# Altium schematic sheet FPGA_POWER_DGND.SchDoc
size A3
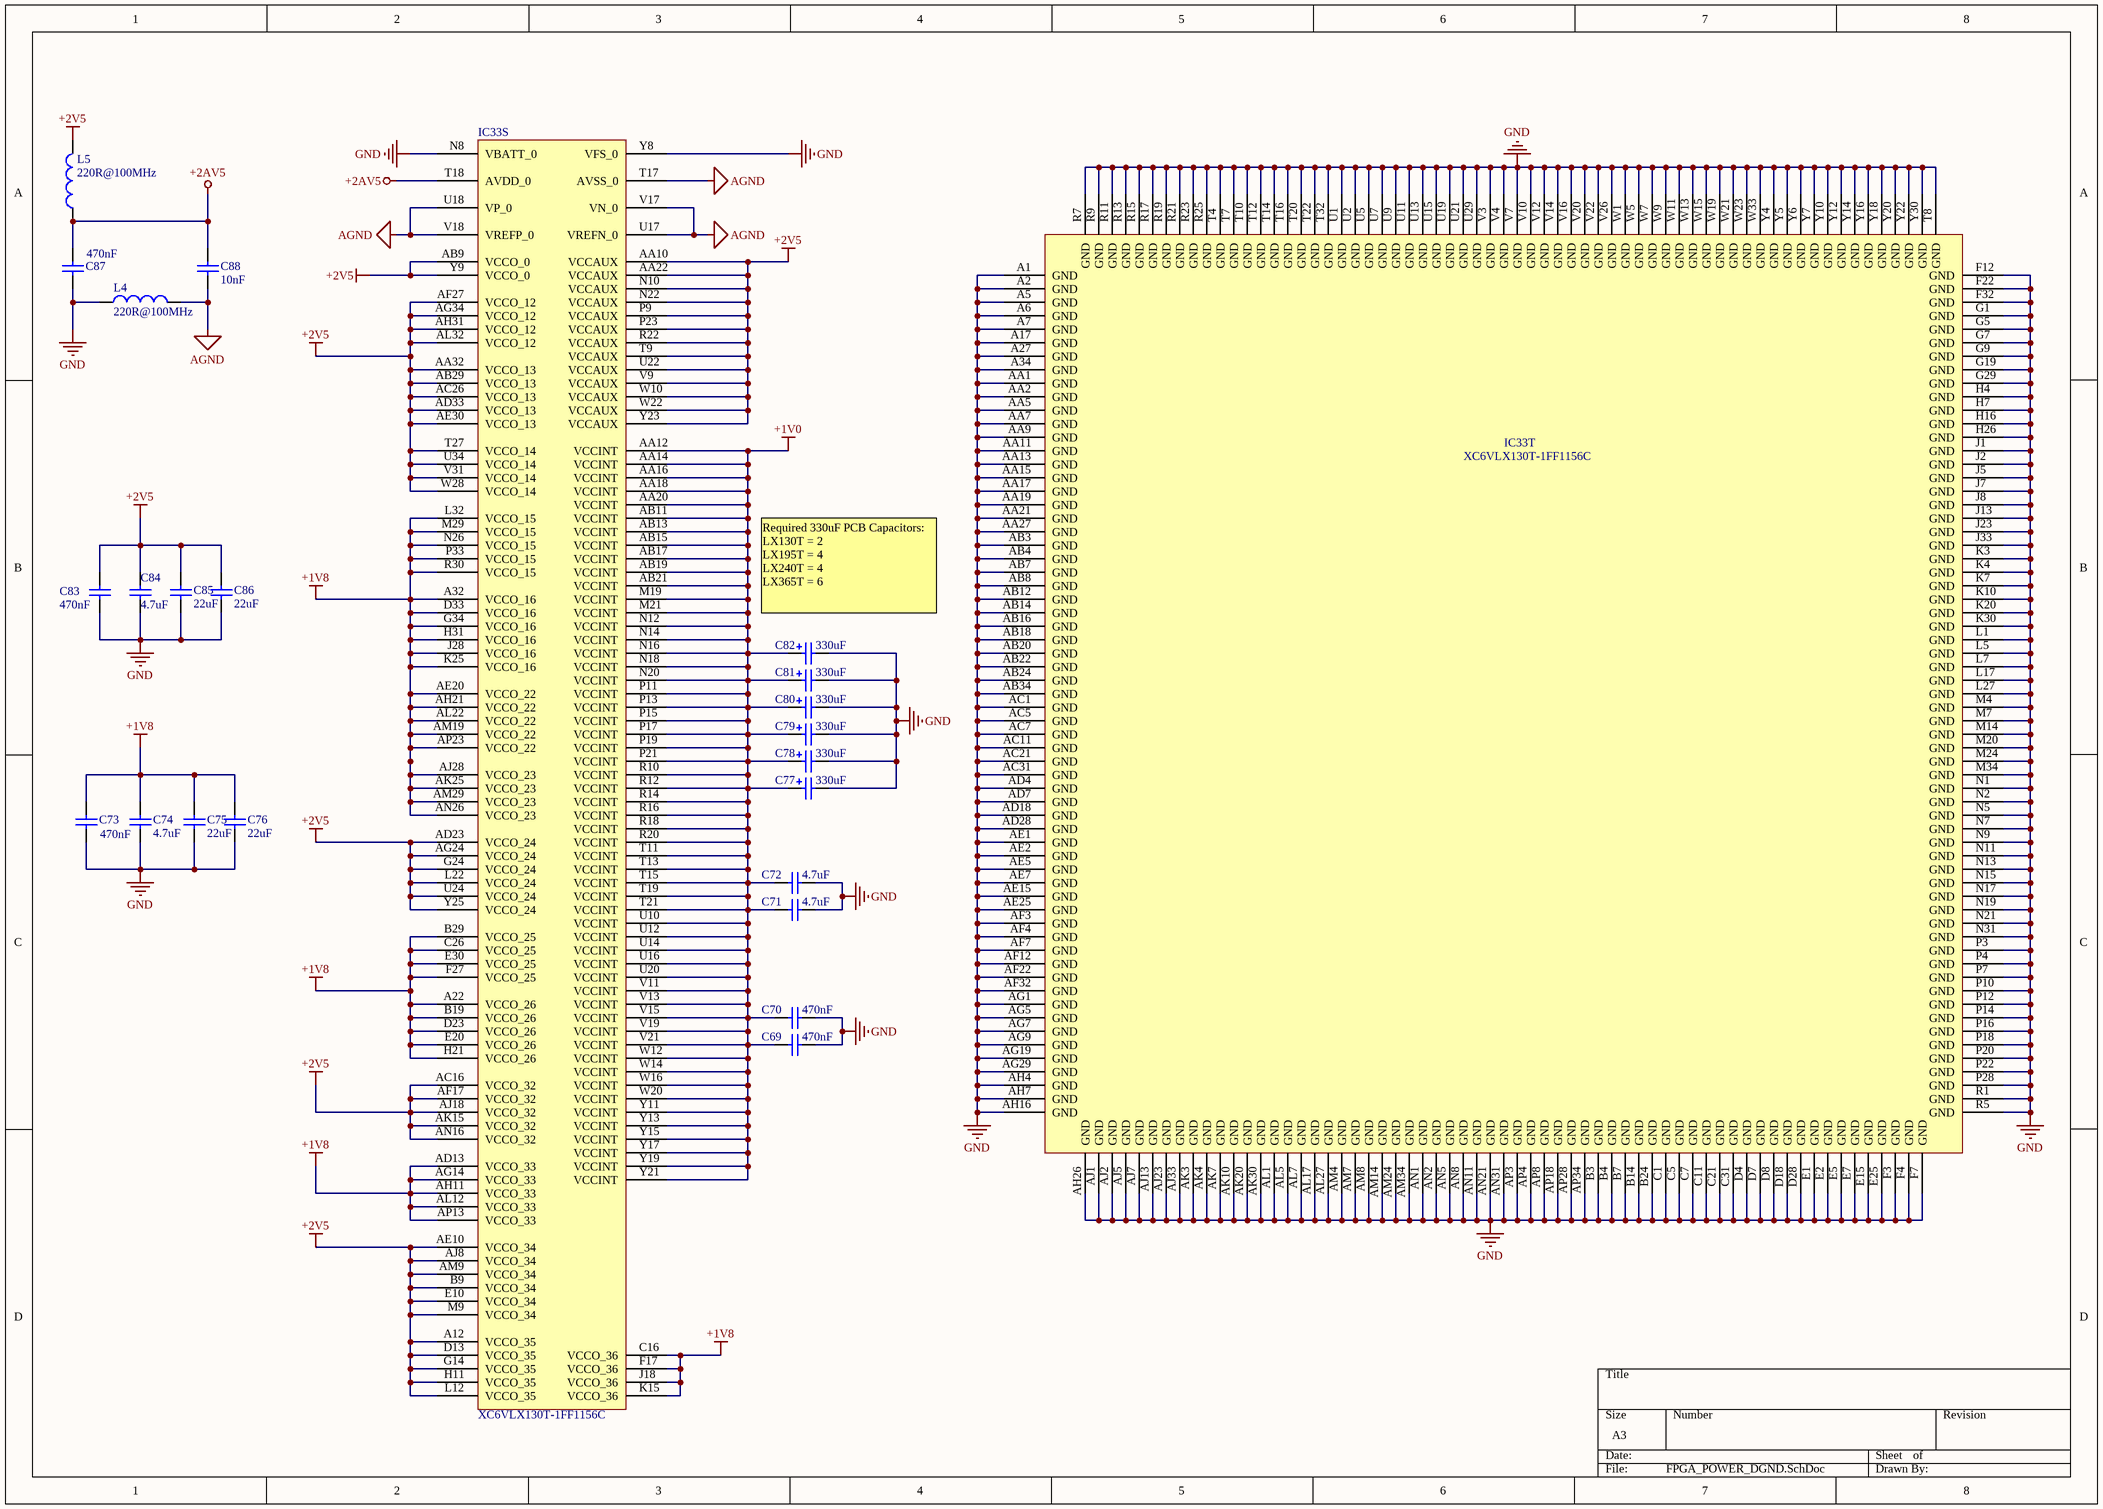
[diagram p0: FPGA_POWER_DGND.SchDoc]

## Parts
C69  470nF  [CC1005-0402]
C70  470nF  [CC1005-0402]
C71  4.7uF  [CC1608-0603]
C72  4.7uF  [CC1608-0603]
C73  470nF  [CC1005-0402]
C74  4.7uF  [CC1608-0603]
C75  22uF  [CC2012-0805]
C76  22uF  [CC2012-0805]
C77  330uF  [D]
C78  330uF  [D]
C79  330uF  [D]
C80  330uF  [D]
C81  330uF  [D]
C82  330uF  [D]
C83  470nF  [CC1005-0402]
C84  4.7uF  [CC1608-0603]
C85  22uF  [CC2012-0805]
C86  22uF  [CC2012-0805]
C87  470nF  [CC1005-0402]
C88  10nF  [CC1005-0402]
IC33  XC6VLX130T-1FF1156C  [FF1156]  (parts S,T of 20)
L4  Impedance: 220R@100MHz  [0603]  (hidden comment: 220R@100MHz Ferrite Bead)
L5  Impedance: 220R@100MHz  [0603]  (hidden comment: 220R@100MHz Ferrite Bead)

## Nets
+1V0: C69.2 C70.2 C71.1 C72.1 C77.1 C78.1 C79.1 C80.1 C81.1 C82.1 IC33.AA12(VCCINT) IC33.AA14(VCCINT) IC33.AA16(VCCINT) IC33.AA18(VCCINT) IC33.AA20(VCCINT) IC33.AB11(VCCINT) IC33.AB13(VCCINT) IC33.AB15(VCCINT) IC33.AB17(VCCINT) IC33.AB19(VCCINT) IC33.AB21(VCCINT) IC33.M19(VCCINT) IC33.M21(VCCINT) IC33.N12(VCCINT) IC33.N14(VCCINT) IC33.N16(VCCINT) IC33.N18(VCCINT) IC33.N20(VCCINT) IC33.P11(VCCINT) IC33.P13(VCCINT) IC33.P15(VCCINT) IC33.P17(VCCINT) IC33.P19(VCCINT) IC33.P21(VCCINT) IC33.R10(VCCINT) IC33.R12(VCCINT) IC33.R14(VCCINT) IC33.R16(VCCINT) IC33.R18(VCCINT) IC33.R20(VCCINT) IC33.T11(VCCINT) IC33.T13(VCCINT) IC33.T15(VCCINT) IC33.T19(VCCINT) IC33.T21(VCCINT) IC33.U10(VCCINT) IC33.U12(VCCINT) IC33.U14(VCCINT) IC33.U16(VCCINT) IC33.U20(VCCINT) IC33.V11(VCCINT) IC33.V13(VCCINT) IC33.V15(VCCINT) IC33.V19(VCCINT) IC33.V21(VCCINT) IC33.W12(VCCINT) IC33.W14(VCCINT) IC33.W16(VCCINT) IC33.W20(VCCINT) IC33.Y11(VCCINT) IC33.Y13(VCCINT) IC33.Y15(VCCINT) IC33.Y17(VCCINT) IC33.Y19(VCCINT) IC33.Y21(VCCINT)
+1V8: C73.1 C74.2 C75.2 C76.2 IC33.A22(VCCO_26) IC33.A32(VCCO_16) IC33.AD13(VCCO_33) IC33.AE20(VCCO_22) IC33.AG14(VCCO_33) IC33.AH11(VCCO_33) IC33.AH21(VCCO_22) IC33.AJ28(VCCO_23) IC33.AK25(VCCO_23) IC33.AL12(VCCO_33) IC33.AL22(VCCO_22) IC33.AM19(VCCO_22) IC33.AM29(VCCO_23) IC33.AN26(VCCO_23) IC33.AP13(VCCO_33) IC33.AP23(VCCO_22) IC33.B19(VCCO_26) IC33.B29(VCCO_25) IC33.C16(VCCO_36) IC33.C26(VCCO_25) IC33.D23(VCCO_26) IC33.D33(VCCO_16) IC33.E20(VCCO_26) IC33.E30(VCCO_25) IC33.F17(VCCO_36) IC33.F27(VCCO_25) IC33.G34(VCCO_16) IC33.H21(VCCO_26) IC33.H31(VCCO_16) IC33.J18(VCCO_36) IC33.J28(VCCO_16) IC33.K15(VCCO_36) IC33.K25(VCCO_16) IC33.L32(VCCO_15) IC33.M29(VCCO_15) IC33.N26(VCCO_15) IC33.P33(VCCO_15) IC33.R30(VCCO_15)
+2AV5: C87.1 C88.1 IC33.T18(AVDD_0) L5.1
+2V5: C83.1 C84.2 C85.2 C86.2 IC33.A12(VCCO_35) IC33.AA10(VCCAUX) IC33.AA22(VCCAUX) IC33.AA32(VCCO_13) IC33.AB9(VCCO_0) IC33.AB29(VCCO_13) IC33.AC16(VCCO_32) IC33.AC26(VCCO_13) IC33.AD23(VCCO_24) IC33.AD33(VCCO_13) IC33.AE10(VCCO_34) IC33.AE30(VCCO_13) IC33.AF17(VCCO_32) IC33.AF27(VCCO_12) IC33.AG24(VCCO_24) IC33.AG34(VCCO_12) IC33.AH31(VCCO_12) IC33.AJ8(VCCO_34) IC33.AJ18(VCCO_32) IC33.AK15(VCCO_32) IC33.AL32(VCCO_12) IC33.AM9(VCCO_34) IC33.AN16(VCCO_32) IC33.B9(VCCO_34) IC33.D13(VCCO_35) IC33.E10(VCCO_34) IC33.G14(VCCO_35) IC33.G24(VCCO_24) IC33.H11(VCCO_35) IC33.L12(VCCO_35) IC33.L22(VCCO_24) IC33.M9(VCCO_34) IC33.N10(VCCAUX) IC33.N22(VCCAUX) IC33.P9(VCCAUX) IC33.P23(VCCAUX) IC33.R22(VCCAUX) IC33.T9(VCCAUX) IC33.T27(VCCO_14) IC33.U22(VCCAUX) IC33.U24(VCCO_24) IC33.U34(VCCO_14) IC33.V9(VCCAUX) IC33.V31(VCCO_14) IC33.W10(VCCAUX) IC33.W22(VCCAUX) IC33.W28(VCCO_14) IC33.Y9(VCCO_0) IC33.Y23(VCCAUX) IC33.Y25(VCCO_24) L5.2
AGND: C88.2 IC33.T17(AVSS_0) IC33.U17(VREFN_0) IC33.U18(VP_0) IC33.V17(VN_0) IC33.V18(VREFP_0) L4.2
GND: C69.1 C70.1 C71.2 C72.2 C73.2 C74.1 C75.1 C76.1 C77.2 C78.2 C79.2 C80.2 C81.2 C82.2 C83.2 C84.1 C85.1 C86.1 C87.2 IC33.A1(GND) IC33.A2(GND) IC33.A5(GND) IC33.A6(GND) IC33.A7(GND) IC33.A17(GND) IC33.A27(GND) IC33.A34(GND) IC33.AA1(GND) IC33.AA2(GND) IC33.AA5(GND) IC33.AA7(GND) IC33.AA9(GND) IC33.AA11(GND) IC33.AA13(GND) IC33.AA15(GND) IC33.AA17(GND) IC33.AA19(GND) IC33.AA21(GND) IC33.AA27(GND) IC33.AB3(GND) IC33.AB4(GND) IC33.AB7(GND) IC33.AB8(GND) IC33.AB12(GND) IC33.AB14(GND) IC33.AB16(GND) IC33.AB18(GND) IC33.AB20(GND) IC33.AB22(GND) IC33.AB24(GND) IC33.AB34(GND) IC33.AC1(GND) IC33.AC5(GND) IC33.AC7(GND) IC33.AC11(GND) IC33.AC21(GND) IC33.AC31(GND) IC33.AD4(GND) IC33.AD7(GND) IC33.AD18(GND) IC33.AD28(GND) IC33.AE1(GND) IC33.AE2(GND) IC33.AE5(GND) IC33.AE7(GND) IC33.AE15(GND) IC33.AE25(GND) IC33.AF3(GND) IC33.AF4(GND) IC33.AF7(GND) IC33.AF12(GND) IC33.AF22(GND) IC33.AF32(GND) IC33.AG1(GND) IC33.AG5(GND) IC33.AG7(GND) IC33.AG9(GND) IC33.AG19(GND) IC33.AG29(GND) IC33.AH4(GND) IC33.AH7(GND) IC33.AH16(GND) IC33.AH26(GND) IC33.AJ1(GND) IC33.AJ2(GND) IC33.AJ5(GND) IC33.AJ7(GND) IC33.AJ13(GND) IC33.AJ23(GND) IC33.AJ33(GND) IC33.AK3(GND) IC33.AK4(GND) IC33.AK7(GND) IC33.AK10(GND) IC33.AK20(GND) IC33.AK30(GND) IC33.AL1(GND) IC33.AL5(GND) IC33.AL7(GND) IC33.AL17(GND) IC33.AL27(GND) IC33.AM4(GND) IC33.AM7(GND) IC33.AM8(GND) IC33.AM14(GND) IC33.AM24(GND) IC33.AM34(GND) IC33.AN1(GND) IC33.AN2(GND) IC33.AN5(GND) IC33.AN8(GND) IC33.AN11(GND) IC33.AN21(GND) IC33.AN31(GND) IC33.AP3(GND) IC33.AP4(GND) IC33.AP8(GND) IC33.AP18(GND) IC33.AP28(GND) IC33.AP34(GND) IC33.B3(GND) IC33.B4(GND) IC33.B7(GND) IC33.B14(GND) IC33.B24(GND) IC33.C1(GND) IC33.C5(GND) IC33.C7(GND) IC33.C11(GND) IC33.C21(GND) IC33.C31(GND) IC33.D4(GND) IC33.D7(GND) IC33.D8(GND) IC33.D18(GND) IC33.D28(GND) IC33.E1(GND) IC33.E2(GND) IC33.E5(GND) IC33.E7(GND) IC33.E15(GND) IC33.E25(GND) IC33.F3(GND) IC33.F4(GND) IC33.F7(GND) IC33.F12(GND) IC33.F22(GND) IC33.F32(GND) IC33.G1(GND) IC33.G5(GND) IC33.G7(GND) IC33.G9(GND) IC33.G19(GND) IC33.G29(GND) IC33.H4(GND) IC33.H7(GND) IC33.H16(GND) IC33.H26(GND) IC33.J1(GND) IC33.J2(GND) IC33.J5(GND) IC33.J7(GND) IC33.J8(GND) IC33.J13(GND) IC33.J23(GND) IC33.J33(GND) IC33.K3(GND) IC33.K4(GND) IC33.K7(GND) IC33.K10(GND) IC33.K20(GND) IC33.K30(GND) IC33.L1(GND) IC33.L5(GND) IC33.L7(GND) IC33.L17(GND) IC33.L27(GND) IC33.M4(GND) IC33.M7(GND) IC33.M14(GND) IC33.M20(GND) IC33.M24(GND) IC33.M34(GND) IC33.N1(GND) IC33.N2(GND) IC33.N5(GND) IC33.N7(GND) IC33.N8(VBATT_0) IC33.N9(GND) IC33.N11(GND) IC33.N13(GND) IC33.N15(GND) IC33.N17(GND) IC33.N19(GND) IC33.N21(GND) IC33.N31(GND) IC33.P3(GND) IC33.P4(GND) IC33.P7(GND) IC33.P10(GND) IC33.P12(GND) IC33.P14(GND) IC33.P16(GND) IC33.P18(GND) IC33.P20(GND) IC33.P22(GND) IC33.P28(GND) IC33.R1(GND) IC33.R5(GND) IC33.R7(GND) IC33.R9(GND) IC33.R11(GND) IC33.R13(GND) IC33.R15(GND) IC33.R17(GND) IC33.R19(GND) IC33.R21(GND) IC33.R23(GND) IC33.R25(GND) IC33.T4(GND) IC33.T7(GND) IC33.T8(GND) IC33.T10(GND) IC33.T12(GND) IC33.T14(GND) IC33.T16(GND) IC33.T20(GND) IC33.T22(GND) IC33.T32(GND) IC33.U1(GND) IC33.U2(GND) IC33.U5(GND) IC33.U7(GND) IC33.U9(GND) IC33.U11(GND) IC33.U13(GND) IC33.U15(GND) IC33.U19(GND) IC33.U21(GND) IC33.U29(GND) IC33.V3(GND) IC33.V4(GND) IC33.V7(GND) IC33.V10(GND) IC33.V12(GND) IC33.V14(GND) IC33.V16(GND) IC33.V20(GND) IC33.V22(GND) IC33.V26(GND) IC33.W1(GND) IC33.W5(GND) IC33.W7(GND) IC33.W9(GND) IC33.W11(GND) IC33.W13(GND) IC33.W15(GND) IC33.W19(GND) IC33.W21(GND) IC33.W23(GND) IC33.W33(GND) IC33.Y4(GND) IC33.Y5(GND) IC33.Y6(GND) IC33.Y7(GND) IC33.Y8(VFS_0) IC33.Y10(GND) IC33.Y12(GND) IC33.Y14(GND) IC33.Y16(GND) IC33.Y18(GND) IC33.Y20(GND) IC33.Y22(GND) IC33.Y30(GND) L4.1

## Notes on the sheet
- (near C82) Required 330uF PCB Capacitors:
  LX130T = 2
  LX195T = 4
  LX240T = 4
  LX365T = 6

## Library data of the parts
C69 C70 C73 C83 C87 = CC0402_470NF_16V_10%_X5R: Capacitor; Manufacturer1: TDK; Manufacturer1 PN: C1005X5R1C474K; TC: X5R; Tolerance: ±10%; Voltage: 16V; Published: 8-Jun-2000; LatestRevisionDate: 17-Jul-2002; LatestRevisionNote: Re-released for DXP Platform.; PackageReference: RAD-0.3; Publisher: Altium Limited; Distributor1: Digikey; Distributor1 PN: 445-4976-1-ND; Case: 0402; Value: 470nF
C71 C72 C74 C84 = CC0603_4.7UF_10V_10%_X5R: Capacitor; Manufacturer1: TDK; Manufacturer1 PN: C1608X5R1A475K; TC: X5R; Tolerance: ±10%; Voltage: 10V; Published: 8-Jun-2000; LatestRevisionDate: 17-Jul-2002; LatestRevisionNote: Re-released for DXP Platform.; PackageReference: RAD-0.3; Publisher: Altium Limited; Distributor1: Digikey; Distributor1 PN: 445-5170-1-ND; Case: 0603; Value: 4.7uF
C75 C76 C85 C86 = CC0805_22UF_6.3V_20%_X5R: Capacitor; Manufacturer1: TDK; Manufacturer1 PN: C2012X5R0J226M; TC: X5R; Tolerance: ±20%; Voltage: 6.3V; Published: 8-Jun-2000; LatestRevisionDate: 17-Jul-2002; LatestRevisionNote: Re-released for DXP Platform.; PackageReference: RAD-0.3; Publisher: Altium Limited; Distributor1: Digikey; Distributor1 PN: 445-1422-1-ND; Case: 0805; Value: 22uF
C77-C82 = CP2917_330UF_6.3V_20%_TANT: Polarized Capacitor Tantalum; Manufacturer1: Kemet; Manufacturer1 PN: T520D337M006ATE025; Tolerance: ±20%; Voltage: 6.3V; ESR: 25mOhm; Published: 8-Jun-2000; LatestRevisionDate: 17-Jul-2002; LatestRevisionNote: Re-released for DXP Platform.; PackageReference: RB7.6-15; Publisher: Altium Limited; Case: 2917; Distributor1: Digikey; Distributor1 PN: 399-4053-1-ND; TC: Tantalum; Value: 330uF
C88 = CC0402_10NF_25V_10%_X7R: Capacitor; Manufacturer1: TDK; Manufacturer1 PN: C1005X7R1E103K; TC: X7R; Tolerance: ±10%; Voltage: 25V; Published: 8-Jun-2000; LatestRevisionDate: 17-Jul-2002; LatestRevisionNote: Re-released for DXP Platform.; PackageReference: RAD-0.3; Publisher: Altium Limited; Distributor1: Digikey; Distributor1 PN: 445-1260-1-ND; Case: 0402; Value: 10nF
IC33 = XC6VLX130T-1FF1156C: Virtex-6 LXT Platform FPGA, 600 User I/Os, 20 GTXs, 1156-Ball FFBGA, Speed Grade 1, Commercial Grade; FirstPublished: 17-Nov-2009; DatasheetVersion: v2.0, Sep-2009; PackageVersion: ver1.0, Jun-2009; PackageReference: FF1156; Publisher: Altium Limited; PackageDescription: 1156-Ball Flip-Chip Fine Pitch Ball Grid Array (FF1156); Code_JEDEC: MS-034-AAR-1; Code_IPC: BGA100P34X34-1156; ComponentLink1Description: Virtex-6 Datasheet; ComponentLink1URL: http://www.xilinx.com/support/documentation/data_sheets/ds150.pdf; ComponentLink2Description: Pinout Specification; ComponentLink2URL: http://www.xilinx.com/support/packagefiles/virtex-6-pkgs.htm; ComponentLink3Description: FF1156 Package Drawing; ComponentLink3URL: http://www.xilinx.com/support/documentation/package_specs/ff1156.pdf; ComponentLink4Description: Virtex-6 Documents; ComponentLink4URL: http://www.xilinx.com/support/documentation/virtex-6.htm; ComponentLink5Description: Xilinx.com Home; ComponentLink5URL: http://www.xilinx.com
L4 L5 = L_FERRITE_BEAD: ferrite bead; Manufacturer1: Murata; Manufacturer1 PN: BLM18KG221SN1D; Current Rating: 2.2A; DCR: 50mOhm; Case: 0603; Distributor1: Digikey; Distributor1 PN: 490-5255-1-ND